# Altium schematic sheet Sheet4.SchDoc
size A4
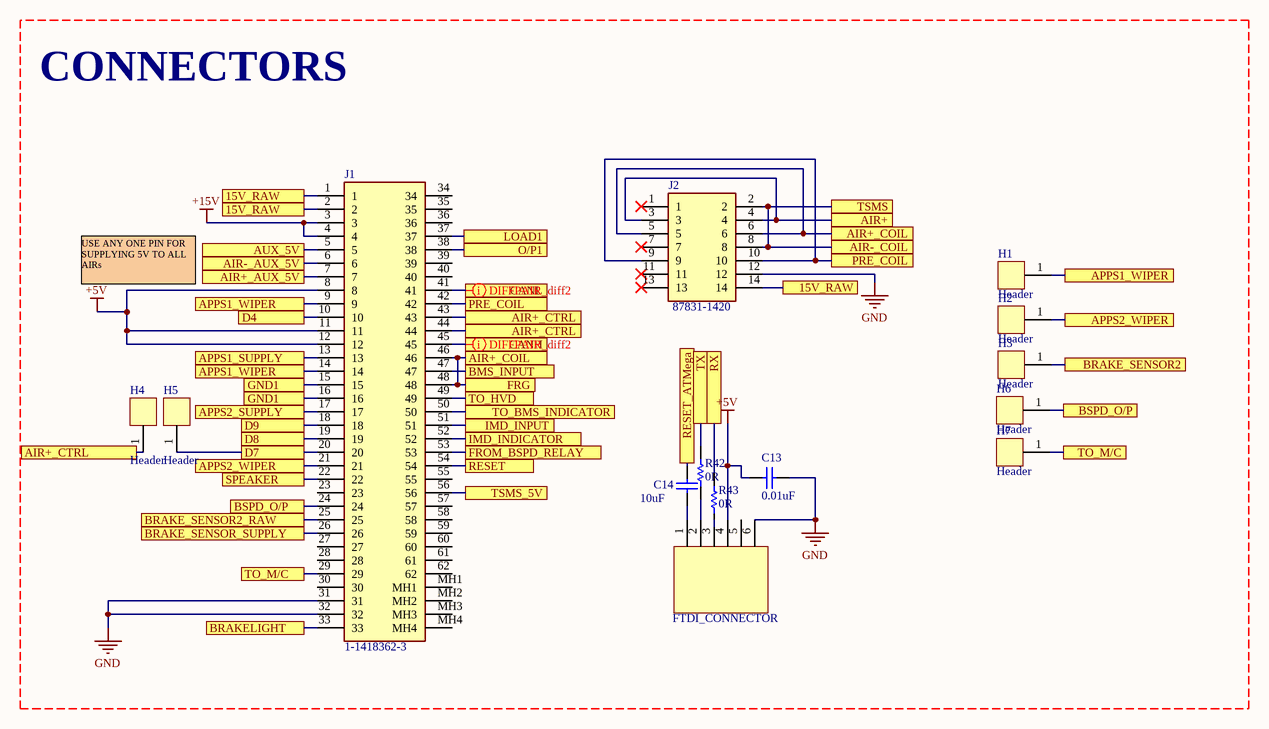
[diagram p0: Sheet4.SchDoc]

## Parts
2  FTDI_connector  [ARDUINO_MEGA_NO_SILK]  (value not drawn)
C13  0.01uF  [KEMT-1206-2_N]
C14  10uF  [KEMT-1206-2_N]
H1  Header  [Header]
H2  Header  [Header]
H3  Header  [Header]
H4  Header  [Header]
H5  Header  [Header]
H6  Header  [Header]
H7  Header  [Header]
J1  1-1418362-3  [114183623]
J2  87831-1420  [SHDR14W55P200_2X7_1665X630X640P]
R42  0R  [R1206]
R43  0R  [R1206]

## Blocks framed on the sheet
CONNECTORS: 2 C13 C14 H1-H7 J1 J2 R42 R43

## Ports
15V_RAW, AIR+, AIR+_AUX_5V, AIR+_COIL, AIR+_CTRL, AIR-_AUX_5V, AIR-_COIL, APPS1_SUPPLY, APPS1_WIPER, APPS2_SUPPLY, APPS2_WIPER, AUX_5V, BMS_INPUT, BRAKE_SENSOR2, BRAKE_SENSOR2_RAW, BRAKE_SENSOR_SUPPLY, BRAKELIGHT, BSPD_O/P, CANH, CANL, D4, D7, D8, D9, FRG, FROM_BSPD_RELAY, GND1, IMD_INDICATOR, IMD_INPUT, LOAD1, O/P1, PRE_COIL, RESET, RESET_ATMega, RX, SPEAKER, TO_BMS_INDICATOR, TO_HVD, TO_M/C, TSMS, TSMS_5V, TX

## Nets
+5V: 2.4 C13.2 J1.8 J1.11 J1.12
+15V: J1.3 J1.4
GND: 2.6 C13.1 J1.31 J1.32 J2.12
15V_RAW: J1.1 J1.2 J2.14 ; port 15V_RAW
AIR+: J2.3 J2.4 ; port AIR+
AIR+_AUX_5V: J1.7 ; port AIR+_AUX_5V
AIR+_COIL: J1.46 J1.48 J2.5 J2.6 ; port AIR+_COIL, port FRG
AIR+_CTRL: H4.1 J1.43 J1.44 ; port AIR+_CTRL
AIR-_AUX_5V: J1.6 ; port AIR-_AUX_5V
AIR-_COIL: J2.2 J2.8 ; port AIR-_COIL, port TSMS
APPS1_SUPPLY: J1.13 ; port APPS1_SUPPLY
APPS1_WIPER: H1.1 J1.9 J1.14 ; port APPS1_WIPER
APPS2_SUPPLY: J1.17 ; port APPS2_SUPPLY
APPS2_WIPER: H2.1 J1.21 ; port APPS2_WIPER
AUX_5V: J1.5 ; port AUX_5V
BMS_INPUT: J1.47 ; port BMS_INPUT
BRAKE_SENSOR2: H3.1 ; port BRAKE_SENSOR2
BRAKE_SENSOR2_RAW: J1.25 ; port BRAKE_SENSOR2_RAW
BRAKE_SENSOR_SUPPLY: J1.26 ; port BRAKE_SENSOR_SUPPLY
BRAKELIGHT: J1.33 ; port BRAKELIGHT
BSPD_O/P: H6.1 J1.24 ; port BSPD_O/P
CANH: J1.45 ; port CANH
CANL: J1.41 ; port CANL
D4: J1.10 ; port D4
D7: H5.1 J1.20 ; port D7
D8: J1.19 ; port D8
D9: J1.18 ; port D9
FROM_BSPD_RELAY: J1.53 ; port FROM_BSPD_RELAY
GND1: J1.15 J1.16 ; port GND1
IMD_INDICATOR: J1.52 ; port IMD_INDICATOR
IMD_INPUT: J1.51 ; port IMD_INPUT
LOAD1: J1.37 ; port LOAD1
O/P1: J1.38 ; port O/P1
PRE_COIL: J1.42 J2.9 J2.10 ; port PRE_COIL
RESET: J1.54 ; port RESET
RESET_ATMega: C14.2 ; port RESET_ATMega
RX: R43.1 ; port RX
SPEAKER: J1.22 ; port SPEAKER
TO_BMS_INDICATOR: J1.50 ; port TO_BMS_INDICATOR
TO_HVD: J1.49 ; port TO_HVD
TO_M/C: H7.1 J1.29 ; port TO_M/C
TSMS_5V: J1.56 ; port TSMS_5V
TX: R42.1 ; port TX
Net2_1: 2.1 C14.1
Net2_2: 2.2 R42.2
Net2_3: 2.3 R43.2

Not connected (* = marked no-connect by the designer): 2 5(2); J1 23 27 28 30 34 35 36 39 40 55 57 58 59 60 61 62 MH1 MH2 MH3 MH4; J2 1* 7* 11* 13*

## Layout directives
differential pair; differential pair class *: CANH, CANL

## Notes on the sheet
- USE ANY ONE PIN FOR SUPPLYING 5V TO ALL AIRs
- (in symbol FTDI_connector) FTDI_CONNECTOR

## Library data of the parts
C13 C14 = CMP-1037-04202-2: CAP, Ceramic, 0.1 uF, +/- 10%, 50 V, -55 to 125 degC, 1206 (3216 Metric), RoHS, Tape and Reel; Manufacturer: Kemet; Voltage Rating: 50V; Capacitance: 0.1µF; Product Range: KEMET-CSeries; SVHC: ToBeAdvised; Dielectric Characteristic: X7R; Capacitor Case Style: 1206[3216Metric]; Package Reference: 1206-2; Package Description: 2-Leads SMD, Body 3.2 x 1.6 mm; Packaging: Tape&Reel; Operating Temperature Max: 125degC; Capacitance Tolerance: ±10%; Datasheet URL: https://datasheet.ciiva.com/6125/1725438-6125494.pdf; Manufacturer URL: http://www.kemet.com/; Operating Temperature Min: -55degC; Datasheet Version: Jul-13
J1 = 1-1418362-3: Connector; Manufacturer_Name: TE Connectivity; Datasheet Link: https://www.arrow.com/en/products/1-1418362-3/te-connectivity; Height: 48mm; Manufacturer_Part_Number: 1-1418362-3; Mouser Part Number: 571-1-1418362-3; Mouser Price/Stock: https://www.mouser.co.uk/ProductDetail/TE-Connectivity-AMP/1-1418362-3?qs=J7fCQMU5Gej7aVw8AejcvQ%3D%3D; Arrow Part Number: 1-1418362-3; Arrow Price/Stock: https://www.arrow.com/en/products/1-1418362-3/te-connectivity
J2 = 87831-1420: Connector; Manufacturer_Name: Molex; Datasheet Link: http://docs-emea.rs-online.com/webdocs/150d/0900766b8150deae.pdf; Height: 6.4mm; Manufacturer_Part_Number: 87831-1420; Mouser Part Number: 538-87831-1420; Mouser Price/Stock: https://www.mouser.co.uk/ProductDetail/Molex/87831-1420/?qs=QtQX4uD3c2VDCL534TqpVg%3D%3D
R42 R43 = RES: Part Number: CRCW120647K0FKEA; Manufacturer: Vishay Dale